# EAGLE schematic Schemat1_SysPodl (EAGLE 9.6.2)

## Sheet 1 of 2
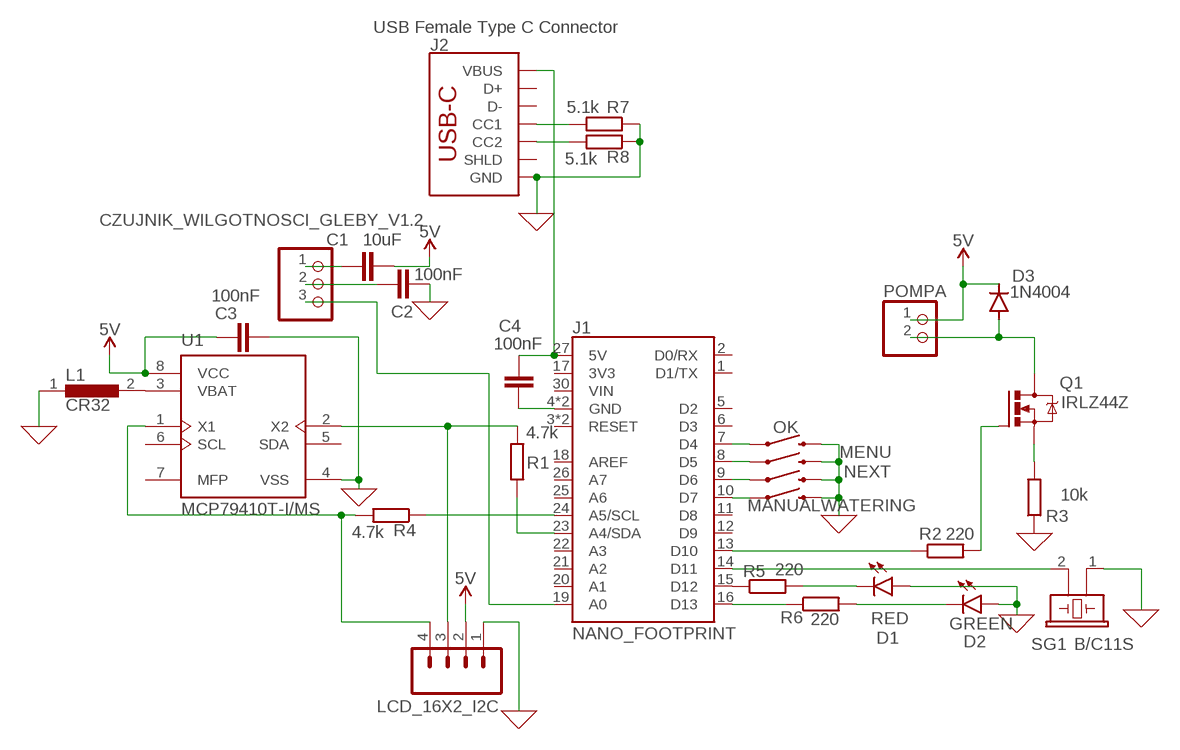
[diagram p0: schematic, sheet 1]

### Parts
C1  10uF  10UF-0402T-6.3V-20%  [0402-TIGHT]
C2  100nF  C  (no package)
C3  100nF  C  (no package)
C4  100nF  C  (no package)
CZUJNIK_WILGOTNOSCI_GLEBY_V1.2  PINHD-1X3  [1X03]
D1  RED  LED-RED0603  [LED-0603]
D2  GREEN  LED-GREEN0603  [LED-0603]
D3  1N4004  [DO41-10]
J1  NANO_FOOTPRINT  [NANO]
J2  USB Female Type C Connector  USB_C_4-LAYER-ISOLATED  [USB-C-16P-4LAYER-ISOLATED]
L1  CR32  [CR32]
LCD_16X2_I2C  CONN_04JST-PTH  [JST-4-PTH]
MANUALWATERING  MOMENTARY-SWITCH-SPST-PTH-6.0MM-KIT  [TACTILE_SWITCH_PTH_6.0MM_KIT]
MENU  MOMENTARY-SWITCH-SPST-PTH-6.0MM-KIT  [TACTILE_SWITCH_PTH_6.0MM_KIT]
NEXT  MOMENTARY-SWITCH-SPST-PTH-6.0MM-KIT  [TACTILE_SWITCH_PTH_6.0MM_KIT]
OK  MOMENTARY-SWITCH-SPST-PTH-6.0MM-KIT  [TACTILE_SWITCH_PTH_6.0MM_KIT]
POMPA  PINHD-1X2  [1X02]
Q1  IRLZ44Z  [TO220BH]
R1  4.7k  R  (no package)
R2  220  R  (no package)
R3  10k  R  (no package)
R4  4.7k  R  (no package)
R5  220  R  (no package)
R6  220  R  (no package)
R7  5.1k  R  (no package)
R8  5.1k  R  (no package)
SG1  B/C11S  [B/C11S]
U1  MCP79410T-I/MS  [MCP79410T-I/MS]

### Nets
0: C2.1 C3.1 D1.A D2.A J2.GND J2.GND2(GND) L1.1 LCD_16X2_I2C.1 MANUALWATERING.3 MENU.3 NEXT.3 OK.3 R3.1 R7.1 R8.1 SG1.1 U1.4(VSS) ; supply symbol labelled GND
5V: C1.2 C3.2 D3.C LCD_16X2_I2C.2 POMPA.1 U1.8(VCC)
N$1: CZUJNIK_WILGOTNOSCI_GLEBY_V1.2.3 J1.19(A0)
N$2: J1.23(A4/SDA) LCD_16X2_I2C.3 R1.1 R1.2 U1.2(X2)
N$3: LCD_16X2_I2C.4 R4.2 U1.1(X1)
N$4: L1.2 U1.3(VBAT)
N$5: C2.2 CZUJNIK_WILGOTNOSCI_GLEBY_V1.2.2
N$6: C1.1 CZUJNIK_WILGOTNOSCI_GLEBY_V1.2.1
N$7: Q1.S R3.2
N$8: D1.C R5.2
N$9: D2.C R6.2
N$10: J1.14(D11) SG1.2
N$11: J1.10(D7) MANUALWATERING.1
N$12: J1.13(D10) R2.1
N$13: Q1.G R2.2
N$14: D3.A POMPA.2 Q1.D
N$15: J1.15(D12) R5.1
N$16: J1.24(A5/SCL) R4.1
N$17: C4.1 J1.27(5V) J2.VBUS1(VBUS) J2.VBUS2(VBUS)
N$18: C4.2 J1.4(GND) J1.29(GND)
N$19: J1.7(D4) OK.1
N$20: J1.16(D13) R6.1
N$21: J1.9(D6) NEXT.1
N$22: J1.8(D5) MENU.1
N$23: J2.B5(CC2) R8.2
N$24: J2.A5(CC1) R7.2
Unconnected: J1.1(D1/TX) J1.2(D0/RX) J1.3(RESET) J1.5(D2) J1.6(D3) J1.11(D8) J1.12(D9) J1.17(3V3) J1.18(AREF) J1.20(A1) J1.21(A2) J1.22(A3) J1.25(A6) J1.26(A7) J1.28(RESET) J1.30(VIN) J2.A6(D+) J2.A7(D-) J2.B6(D+) J2.B7(D-) J2.SHLD1(SHLD) J2.SHLD2(SHLD) J2.SHLD3(SHLD) J2.SHLD4(SHLD) J2.SHLD5(SHLD) J2.SHLD6(SHLD) J2.SHLD7(SHLD) J2.SHLD8(SHLD) U1.5(SDA) U1.6(SCL) U1.7(MFP)

## Sheet 2 of 2

## Library data of the parts
C1 = SparkFun-Capacitors:10UF: 10.0µF ceramic capacitors A capacitor is a passive two-terminal electrical component used to store electrical energy temporarily in an electric field.; PROD_ID: CAP-14848
C2-C4 = ngspice-simulation:C: CAPACITOR
CZUJNIK_WILGOTNOSCI_GLEBY_V1.2 = pinhead:PINHD-1X3: PIN HEADER
D1 = SparkFun-LED:LED-RED: Red SMD LED Used in manufacturing of most products at SparkFun Packages: 0603 - KB - KingBright (DIO-17976) SMD 0603 package [Datasheet] <https://www.kingbrightusa.com/images/catalog/SPEC/APT1608SURCK.pdf> 0603 - (DIO-00819, has gone EOL) SMD 0603 package 0603 SMART - SMD 0603 SMART package ( more efficient and expensive)[Product Link] <http://www.osram-os.com/Graphics/XPic2/00077099_0.pdf> 1206 - SMD1206 package [Product Link] <https://www.sparkfun.com/datasheets/DevTools/LilyPad/Q150OVS4.pdff> SparkFun Products: Pro Mini 328 -5V <https://www.sparkfun.com/products/821> RedBoard <https://www.sparkfun.com/products/12757> IOIO-OTG <https://www.sparkfun.com/products/13613>; PROD_ID: DIO-00819
D2 = SparkFun-LED:LED-GREEN: Green SMD LED Used in manufacturing of various products at SparkFun Packages: 0603 - SMD 0603 package [Product Link] <http://www.futureelectronics.com/en/technologies/semiconductors/optoelectronics/leds/Pages/9894312-LTST-C190GKT.aspx?CrossPart=HSMG-C190&IM=0> LilyPad 1206 - SMD1206 LilyPad package [Product Link] <http://www.futureelectronics.com/en/Technologies/Product.aspx?ProductID=IN150NGHARVATEKCORPORATION2049943&IM=0> 1206 - SMD1206 package [Product Link] <http://www.futureelectronics.com/en/technologies/semiconductors/optoelectronics/leds/Pages/8315665-LTST-C150KGKT.aspx?IM=0> 1206 Bottom Mount -SMD 1206 Bottom Mount [Product Link] <http://www.digikey.com/product-detail/en/lite-on-inc/LTST-C230KGKT/160-1456-1-ND/386854> SparkFun Products: Pro Mini 328 -5V <https://www.sparkfun.com/products/821> RedBoard <https://www.sparkfun.com/products/12757> MP3 Trigger <https://www.sparkfun.com/products/13720> Makey Makey <https://www.sparkfun.com/products/11076>; PROD_ID: DIO-00821
D3 = diode:1N4004: DIODE general purpose rectifier, 1 A
J1 = SparkFun-Boards:NANO_FOOTPRINT: Generic Nano Footprint
J2 = SparkFun-Connectors:USB_C: USB Type C 16Pin Connector Super Speed pins not available on the 16-pin purely SMD connector so this part is best for USB 2.0 implementations. D1 and D2 are tied together enabling D+/- no matter which way the cable is plugged into the connector. The two channel configuration pins (CC1/2) are exposed. These are normally connected to ground via 5.1k resistors but can be reconfigured for high current/high power applications. **4-LAYER BOARD WARNING!!** If designing 4-layer board, make sure to select the variant _4-LAYER-ISOLATED. The linked footprint (USB-C-16-4LAYER-ISOLATED) includes some very necessary cutout polygons in the inner layers (2 and 15). This prevents the PTH mounting shield legs on the USB connector from electrically connecting any other polygons on the inner layers (usually VCC and GND).; PROD_ID: CONN-14122
L1 = inductors:CR32: POWER INDUCTORS SMD CR Series Source: www.suminda.com .. CR32.pdf; SPICEPREFIX: L
LCD_16X2_I2C = SparkFun-Connectors:CONN_04: Multi connection point. Often used as Generic Header-pin footprint for 0.1 inch spaced/style header connections On any of the 0.1 inch spaced packages, you can populate with these: Break Away Headers - Straight <https://www.sparkfun.com/products/116> (PRT-00116) Break Away Male Headers - Right Angle <https://www.sparkfun.com/products/553> (PRT-00553) Female Headers <https://www.sparkfun.com/products/115> (PRT-00115) Break Away Headers - Machine Pin <https://www.sparkfun.com/products/117> (PRT-00117) Break Away Female Headers - Swiss Machine Pin <https://www.sparkfun.com/products/743> (PRT-00743) For SCREWTERMINALS and SPRING TERMINALS visit here: Screw Terimnals on SparkFun.com <https://www.sparkfun.com/search/results?term=Screw+Terminals> (5mm/3.5mm/2.54mm spacing) This device is also useful as a general connection point to wire up your design to another part of your project. Our various solder wires solder well into these plated through hole pads. Hook-Up Wire - Assortment (Stranded, 22 AWG) <https://www.sparkfun.com/products/11375> (PRT-11375) Hook-Up Wire - Assortment (Solid Core, 22 AWG) <https://www.sparkfun.com/products/11367> (PRT-11367) View the entire wire category on our website here <https://www.sparkfun.com/categories/141> Special notes: Molex polarized connector foot print use with SKU : PRT-08231 with associated crimp pins and housings. 1MM SMD Version SKU: PRT-10208; PROD_ID: WIRE-13531; SF_ID: PRT-09916
MANUALWATERING MENU NEXT OK = SparkFun-Switches:MOMENTARY-SWITCH-SPST: Momentary Switch (Pushbutton) - SPST Normally-open (NO) SPST momentary switches (buttons, pushbuttons). Variants PTH-12MM - 12mm square, through-hole Momentary Pushbutton Switch - 12mm Square <https://www.sparkfun.com/products/9190> (COM-09190) PTH-6.0MM, PTH-6.0MM-KIT - 6.0mm square, through-hole Mini Pushbutton Switch <https://www.sparkfun.com/products/97> (COM-00097) KIT package intended for soldering kit's - only one side of pads' copper is exposed. PTH-RIGHT-ANGLE-KIT - Right-angle, through-hole Right Angle Tactile Button <https://www.sparkfun.com/products/10791> - Used on SparkFun BigTime Watch Kit <https://www.sparkfun.com/products/11734> SMD-12MM - 12mm square, surface-mount Tactile Button - SMD (12mm) <https://www.sparkfun.com/products/12993> (COM-12993) Used on SparkFun PicoBoard <https://www.sparkfun.com/products/11888> SMD-4.5MM - 4.5mm Square Trackball Switch Used on SparkFun Blackberry Trackballer Breakout <https://www.sparkfun.com/products/13169> SMD-4.6MMX2.8MM - 4.60mm x 2.80mm, surface mount Used on SparkFun Pro Micro - RP2040 <https://www.sparkfun.com/products/17717> SMD-5.2MM, SMD-5.2-REDUNDANT - 5.2mm square, surface-mount Mini Pushbutton Switch - SMD <https://www.sparkfun.com/products/8720> (COM-08720) Used on Arduino Pro Mini <https://www.sparkfun.com/products/11114> REDUNDANT package connects both switch circuits together SMD-6.0X3.5MM - 6.0 x 3.5mm, surface mount Momentary Reset Switch SMD <https://www.sparkfun.com/products/8229> (COM-08229) SMD-6.2MM-TALL - 6.2mm square, surface mount Tactile Button - SMD (6mm) <https://www.sparkfun.com/products/12992> Used on SparkFun Digital Sandbox <https://www.sparkfun.com/products/12651> SMD-RIGHT-ANGLE - Right-angle, surface mount Used on SparkFun Block for Intel® Edison - Arduino <https://www.sparkfun.com/products/13036>; PROD_ID: SWCH-08441; SF_SKU: COM-00097
POMPA = pinhead:PINHD-1X2: PIN HEADER
Q1 = transistor-power:IRLZ44Z: N-Channel HEXFET® Power MOSFET Logic Level AUTOMOTIVE MOSFET Source: http://www.irf.com/product-info/datasheets/data/irlz44zpbf.pdf
R1-R8 = ngspice-simulation:R: RESISTOR
SG1 = buzzer:B/C11S: BUZZER Source: Buerklin; OC_FARNELL: unknown; OC_NEWARK: unknown
U1 = RTC:MCP79410T-I/MS: IC RTC CLK/CALENDAR I2C 8-MSOP Manufacturer's datasheet <https://s3.amazonaws.com/snapeda/datasheet/MCP79410T-I/MS_Microchip.pdf>; CREATED_BY: PCBLayout.com; DIGIKEY_PARTNO: MCP79410T-I/MSCT-ND; MANUFACTURER: Microchip Technology; MPN: MCP79410T-I/MS; PACKAGE: 8-MSOP